# Altium schematic sheet Compute_Module_CAMERA.SchDoc: STM32F446 CNC
size B; Author: AM; CompanyName: Expatria Technologies; DrawnBy: A.Marles; Engineer: AM; Organization: Expatria Technolgoies; Address1: 1136 Glade Court; Address3: Port Coquitlam, BC V3B 1R5; Address4: Canada; DocumentNumber: 10; SheetNumber: 10; SheetTotal: 30
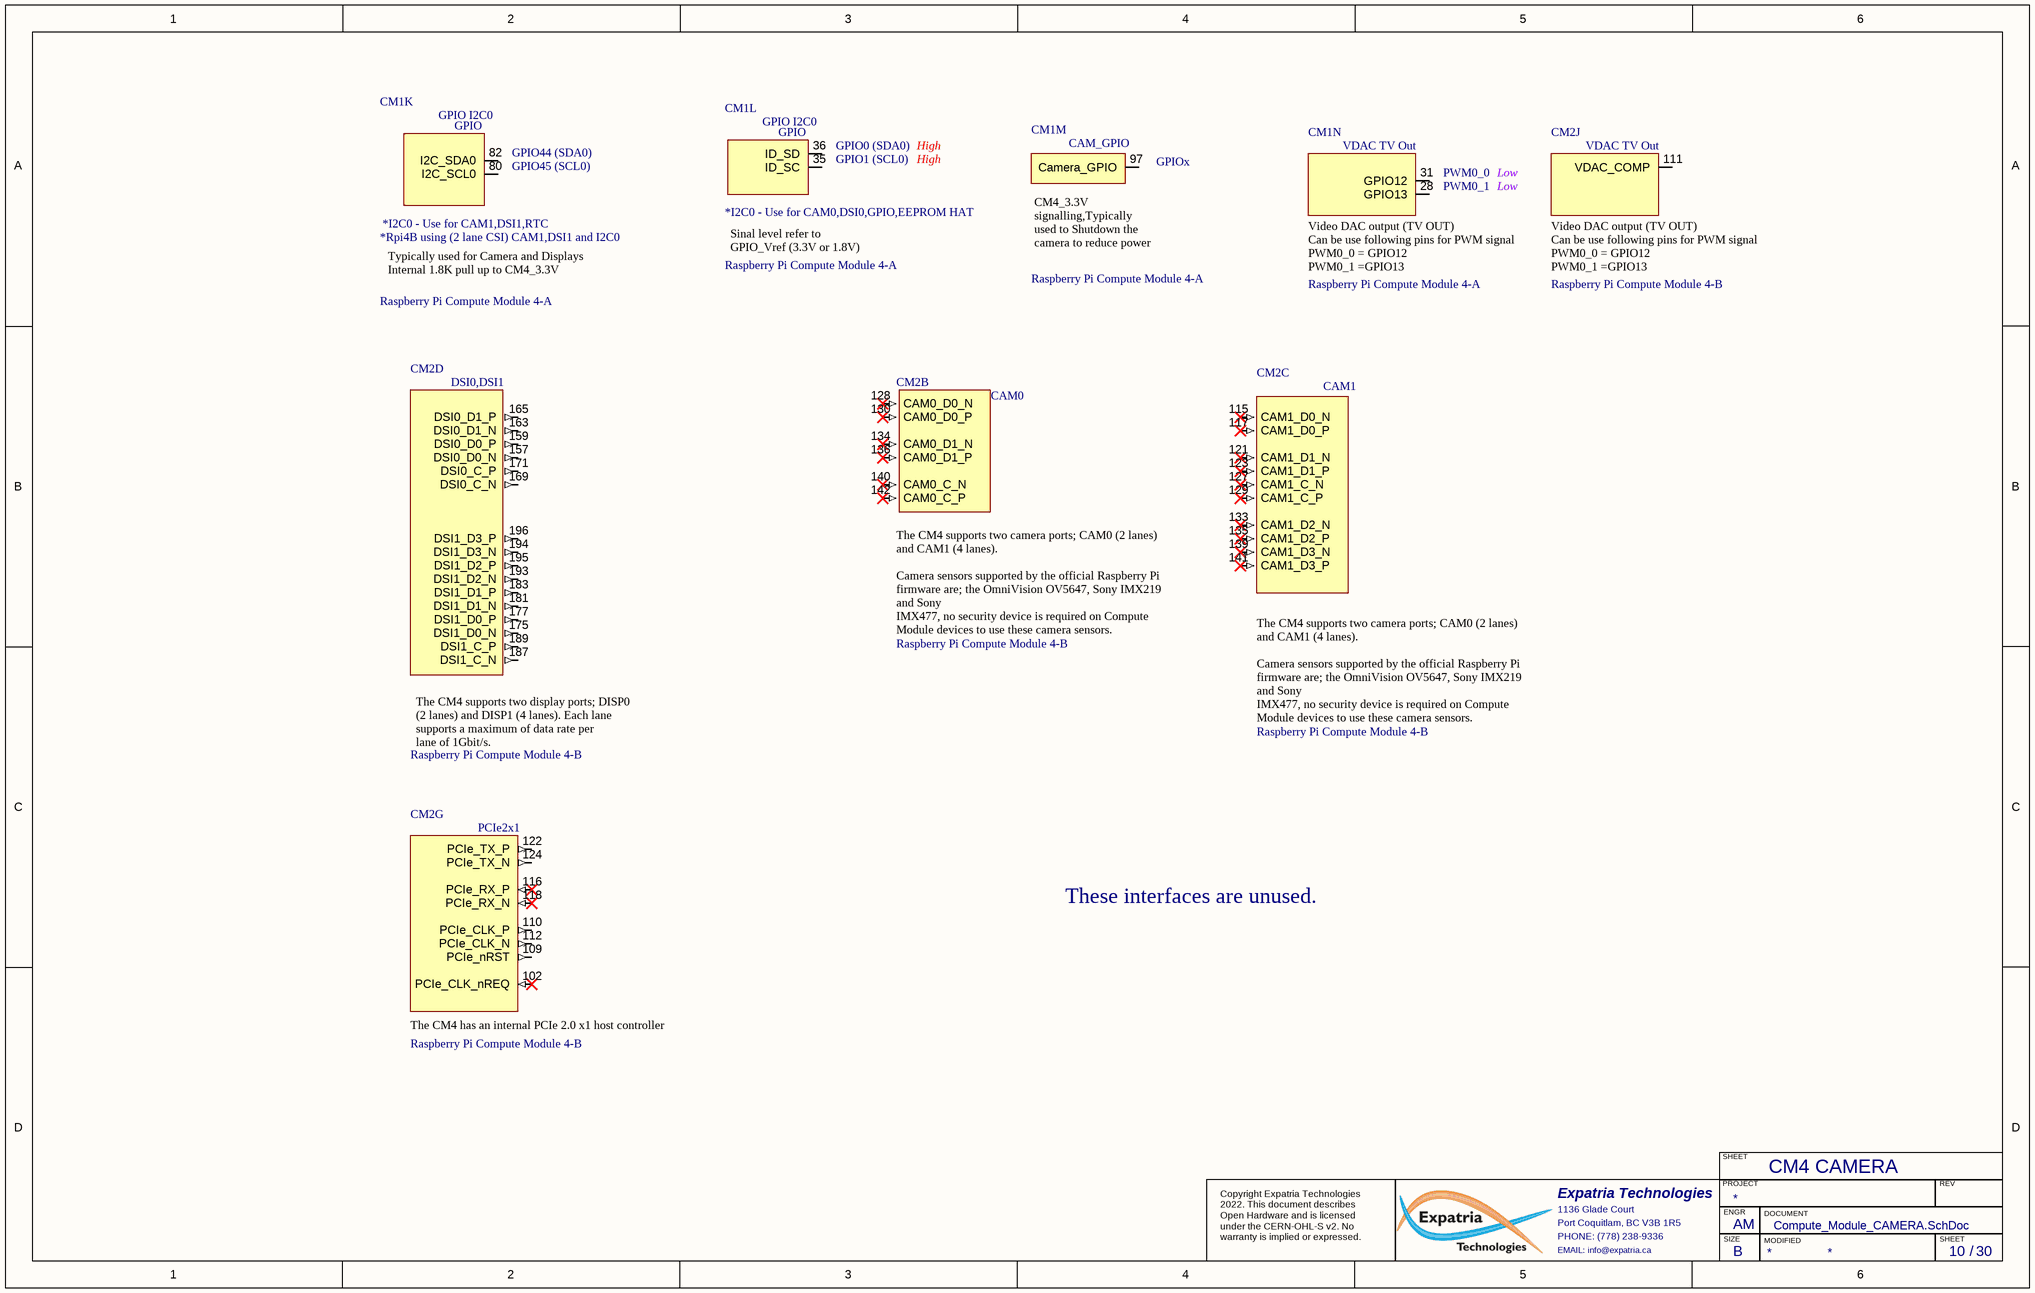
[diagram p0: Compute_Module_CAMERA.SchDoc]

## Parts
CM1  Raspberry Pi Compute Module 4-A  [DF40HC30100DS04V51]  (parts K,L,M,N of 14)
CM2  Raspberry Pi Compute Module 4-B  [DF40HC30100DS04V51 - p101-200]  (parts B,C,D,G,J of 10)

## Nets

Not connected (* = marked no-connect by the designer): CM1 28(GPIO13) 31(GPIO12) 35(ID_SC) 36(ID_SD) 80(I2C_SCL0) 82(I2C_SDA0) 97(Camera_GPIO); CM2 102(PCIe_CLK_nREQ)* 109(PCIe_nRST) 110(PCIe_CLK_P) 111(VDAC_COMP) 112(PCIe_CLK_N) 115(CAM1_D0_N)* 116(PCIe_RX_P)* 117(CAM1_D0_P)* 118(PCIe_RX_N)* 121(CAM1_D1_N)* 122(PCIe_TX_P) 123(CAM1_D1_P)* 124(PCIe_TX_N) 127(CAM1_C_N)* 128(CAM0_D0_N)* 129(CAM1_C_P)* 130(CAM0_D0_P)* 133(CAM1_D2_N)* 134(CAM0_D1_N)* 135(CAM1_D2_P)* 136(CAM0_D1_P)* 139(CAM1_D3_N)* 140(CAM0_C_N)* 141(CAM1_D3_P)* 142(CAM0_C_P)* 157(DSI0_D0_N) 159(DSI0_D0_P) 163(DSI0_D1_N) 165(DSI0_D1_P) 169(DSI0_C_N) 171(DSI0_C_P) 175(DSI1_D0_N) 177(DSI1_D0_P) 181(DSI1_D1_N) 183(DSI1_D1_P) 187(DSI1_C_N) 189(DSI1_C_P) 193(DSI1_D2_N) 194(DSI1_D3_N) 195(DSI1_D2_P) 196(DSI1_D3_P)

## Notes on the sheet
- These interfaces are unused.
- CM4 CAMERA
- SHEET
- Expatria Technologies
- 1136 Glade Court
- Port Coquitlam, BC V3B 1R5
- PHONE: (778) 238-9336
- PROJECT
- SIZE
- ENGR
- MODIFIED
- DOCUMENT
- REV
- Copyright Expatria Technologies 2022. This document describes Open Hardware and is licensed under the CERN-OHL-S v2. No warranty is implied or expressed.
- EMAIL: info@expatria.ca
- B
- /
- (in symbol CM4_Module_A, part K) GPIO I2C0; GPIO; GPIO44 (SDA0); GPIO45 (SCL0); *I2C0 - Use for CAM1,DSI1,RTC; *Rpi4B using (2 lane CSI) CAM1,DSI1 and I2C0; Typically used for Camera and Displays Internal 1.8K pull up to CM4_3.3V
- (in symbol CM4_Module_A, part L) GPIO I2C0; GPIO; GPIO0 (SDA0); High; GPIO1 (SCL0); *I2C0 - Use for CAM0,DSI0,GPIO,EEPROM HAT; Sinal level refer to  GPIO_Vref (3.3V or 1.8V)
- (in symbol CM4_Module_A, part M) CAM_GPIO; GPIOx; CM4_3.3V signalling,Typically used to Shutdown the camera to reduce power
- (in symbol CM4_Module_A, part N) VDAC TV Out; PWM0_0; Low; PWM0_1; Video DAC output (TV OUT) / Can be use following pins for PWM signal / PWM0_0 = GPIO12 / PWM0_1 =GPIO13
- (in symbol CM4_Module_B, part B) CAM0; The CM4 supports two camera ports; CAM0 (2 lanes) and CAM1 (4 lanes). / Camera sensors supported by the official Raspberry Pi firmware are; the OmniVision OV5647, Sony IMX219 and Sony / IMX477, no security device is required on Compute Module devices to use these camera sensors.
- (in symbol CM4_Module_B, part C) CAM1; The CM4 supports two camera ports; CAM0 (2 lanes) and CAM1 (4 lanes). / Camera sensors supported by the official Raspberry Pi firmware are; the OmniVision OV5647, Sony IMX219 and Sony / IMX477, no security device is required on Compute Module devices to use these camera sensors.
- (in symbol CM4_Module_B, part D) DSI0,DSI1; The CM4 supports two display ports; DISP0 (2 lanes) and DISP1 (4 lanes). Each lane supports a maximum of data rate per / lane of 1Gbit/s.
- (in symbol CM4_Module_B, part G) PCIe2x1; The CM4 has an internal PCIe 2.0 x1 host controller
- (in symbol CM4_Module_B, part J) VDAC TV Out; Video DAC output (TV OUT) / Can be use following pins for PWM signal / PWM0_0 = GPIO12 / PWM0_1 =GPIO13

## Library data of the parts
CM1 = CM4_Module_A: Raspberry Pi Compute Module 4 Pins 1-100 (Connector A); Manufacturer: Hirose; Manufacturer Part Number: DF40HC(3.0)-100DS-0.4V(51); SuppliersPartNumber: C424649; Supplier: LCSC; Value: CM4_Module_A
CM2 = CM4_Module_B: Raspberry Pi Compute Module 4 Pins 101-200 (Connector B); Manufacturer: Hirose; Manufacturer Part Number: DF40HC(3.0)-100DS-0.4V(51); SuppliersPartNumber: C424649; Supplier: LCSC; Value: CM4_Module_B